# EAGLE design IO4-IR-Detector-Active (EAGLE 7.7.0)
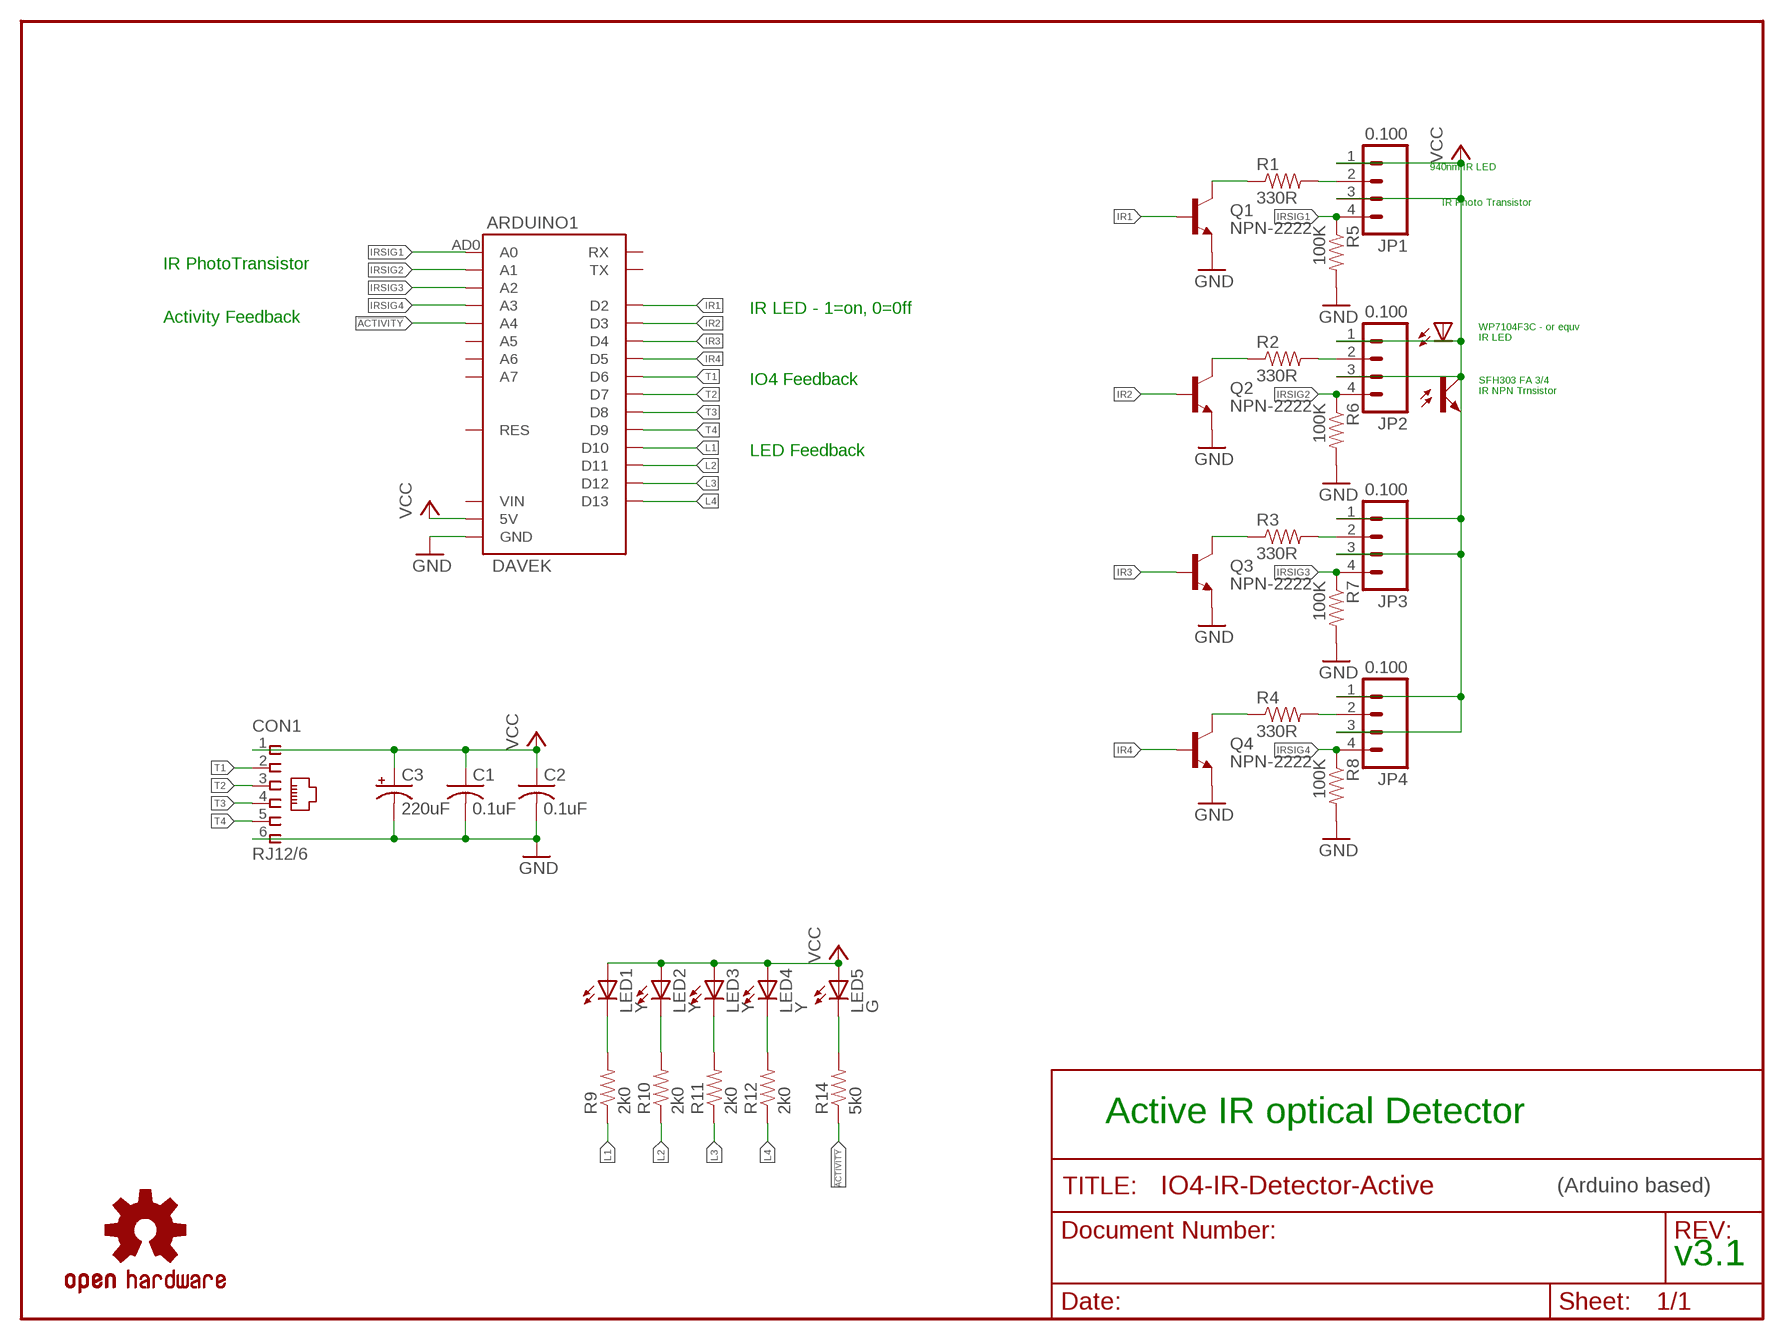
[diagram p0: schematic, sheet 1]

## Parts
ARDUINO1  DAVEK  ARDUINO-PRO-MINIDAVESROBOT  [ARDUINO_PRO_MINI_DAVEK]
C1  0.1uF  CAP0603  [0603-CAP]
C2  0.1uF  CAP0603  [0603-CAP]
C3  220uF  CAP-POL0810  [0810-CAP]
CON1  RJ12/6  CONNECTOR-RJ25-6P6C  [RJ25-PANEL]
JP1  0.100  CONNECTOR-M04LOCK  [1X04_LOCK]
JP2  0.100  CONNECTOR-M04LOCK  [1X04_LOCK]
JP3  0.100  CONNECTOR-M04LOCK  [1X04_LOCK]
JP4  0.100  CONNECTOR-M04LOCK  [1X04_LOCK]
LED1  Y  LED0603-LED  [0603-LED]
LED2  Y  LED0603-LED  [0603-LED]
LED3  Y  LED0603-LED  [0603-LED]
LED4  Y  LED0603-LED  [0603-LED]
LED5  G  LED0603-LED  [0603-LED]
OSH_LOGO  DOC-OSHW-LOGO-S  [OSHW-LOGO-S]
Q1  NPN-2222  NPN-SOT23  [SOT23]
Q2  NPN-2222  NPN-SOT23  [SOT23]
Q3  NPN-2222  NPN-SOT23  [SOT23]
Q4  NPN-2222  NPN-SOT23  [SOT23]
R1  330R  R0603-RES  [0603-RES]
R2  330R  R0603-RES  [0603-RES]
R3  330R  R0603-RES  [0603-RES]
R4  330R  R0603-RES  [0603-RES]
R5  100K  R0603-RES  [0603-RES]
R6  100K  R0603-RES  [0603-RES]
R7  100K  R0603-RES  [0603-RES]
R8  100K  R0603-RES  [0603-RES]
R9  2k0  R0603-RES  [0603-RES]
R10  2k0  R0603-RES  [0603-RES]
R11  2k0  R0603-RES  [0603-RES]
R12  2k0  R0603-RES  [0603-RES]
R14  5k0  R0603-RES  [0603-RES]

## Nets
!ACTIVITY: ARDUINO1.AD4(A4) R14.1
GND [Power]: ARDUINO1.GND@1(GND) ARDUINO1.GND@2(GND) ARDUINO1.GND@4(GND) C1.2 C2.2 C3.- CON1.6 Q1.2(E) Q2.2(E) Q3.2(E) Q4.2(E) R5.2 R6.2 R7.2 R8.2
IR1: ARDUINO1.D2 Q1.1(B)
IR2: ARDUINO1.D3 Q2.1(B)
IR3: ARDUINO1.D4 Q3.1(B)
IR4: ARDUINO1.D5 Q4.1(B)
IRDRIVE1 [Power]: Q1.3(C) R1.1
IRDRIVE2 [Power]: Q2.3(C) R2.1
IRDRIVE3 [Power]: Q3.3(C) R3.1
IRDRIVE4 [Power]: Q4.3(C) R4.1
IRSIG1 [Power]: ARDUINO1.AD0(A0) JP1.4 R5.1
IRSIG2 [Power]: ARDUINO1.AD1(A1) JP2.4 R6.1
IRSIG3 [Power]: ARDUINO1.AD2(A2) JP3.4 R7.1
IRSIG4 [Power]: ARDUINO1.AD3(A3) JP4.4 R8.1
L1: ARDUINO1.D10 R9.1
L2: ARDUINO1.D11 R10.1
L3 [Power]: ARDUINO1.D12 R11.1
L4 [Power]: ARDUINO1.D13 R12.1
N$1: LED5.C R14.2
N$2 [Power]: JP1.2 R1.2
N$3: JP2.2 R2.2
N$4 [Power]: JP3.2 R3.2
N$5: JP4.2 R4.2
N$10 [Power]: LED1.C R9.2
N$11 [Power]: LED2.C R10.2
N$12 [Power]: LED3.C R11.2
N$13 [Power]: LED4.C R12.2
T1: ARDUINO1.D6 CON1.2
T2 [Power]: ARDUINO1.D7 CON1.3
T3 [Power]: ARDUINO1.D8 CON1.4
T4: ARDUINO1.D9 CON1.5
VCC [Power]: ARDUINO1.5V C1.1 C2.1 C3.+ CON1.1 JP1.1 JP1.3 JP2.1 JP2.3 JP3.1 JP3.3 JP4.1 JP4.3 LED1.A LED2.A LED3.A LED4.A LED5.A
Unconnected: ARDUINO1.AD5(A5) ARDUINO1.AD6(A6) ARDUINO1.AD7(A7) ARDUINO1.RES ARDUINO1.RES@1(RES) ARDUINO1.RX ARDUINO1.TX@1(TX) ARDUINO1.VIN

## Notes on the sheet
- 940nm IR LED
- IR Photo Transistor
- IR PhotoTransistor
- IR LED - 1=on, 0=0ff
- Activity Feedback
- WP7104F3C - or equv
  IR LED
- IO4 Feedback
- SFH303 FA 3/4
  IR NPN Trnsistor
- LED Feedback
- Active IR optical Detector
- (Arduino based)
- v3.1

## Library data of the parts
ARDUINO1 = SPCoast:ARDUINO-PRO-MINI
C1 C2 = SPCoast:CAP*
C3 = SPCoast:CAP-POL*
CON1 = SPCoast:CONNECTOR-RJ25: AMP connector; AMP: 520250-3; OPL: none
JP1-JP4 = SPCoast:CONNECTOR-M04: Header 4 Standard 4-pin 0.1" header. Use with straight break away headers (SKU : PRT-00116), right angle break away headers (PRT-00553), swiss pins (PRT-00743), machine pins (PRT-00117), and female headers (PRT-00115). Molex polarized connector foot print use with SKU : PRT-08231 with associated crimp pins and housings. 1MM SMD Version SKU: PRT-10208
LED1-LED5 = SPCoast:LED*
OSH_LOGO = SPCoast:DOC-OSHW-LOGO-: Open Source Hardware Logo This logo indicates the piece of hardware it is found on incorporates a OSHW license and/or adheres to the definition of open source hardware http://freedomdefined.org/OSHW Creative Commons - Attribution - ShareAlike 3.0
Q1-Q4 = SPCoast:NPN: Transistor NPN BJT configuration in SOT23 package. MMBT2222 is the common NPN we use. Double check BCE configuration again layout.
R1-R12 R14 = SPCoast:R*: Resistor Basic schematic elements and footprints for 0603, 1206, and PTH 1/10th watt (small) resistors.

## Net classes
0 default: width 0.254 mm
1 Power: width 0.254 mm, clearance 0.203 mm
2 DCC: width 1.778 mm, drill 0.039 mm, clearance 0.203 mm

## Board
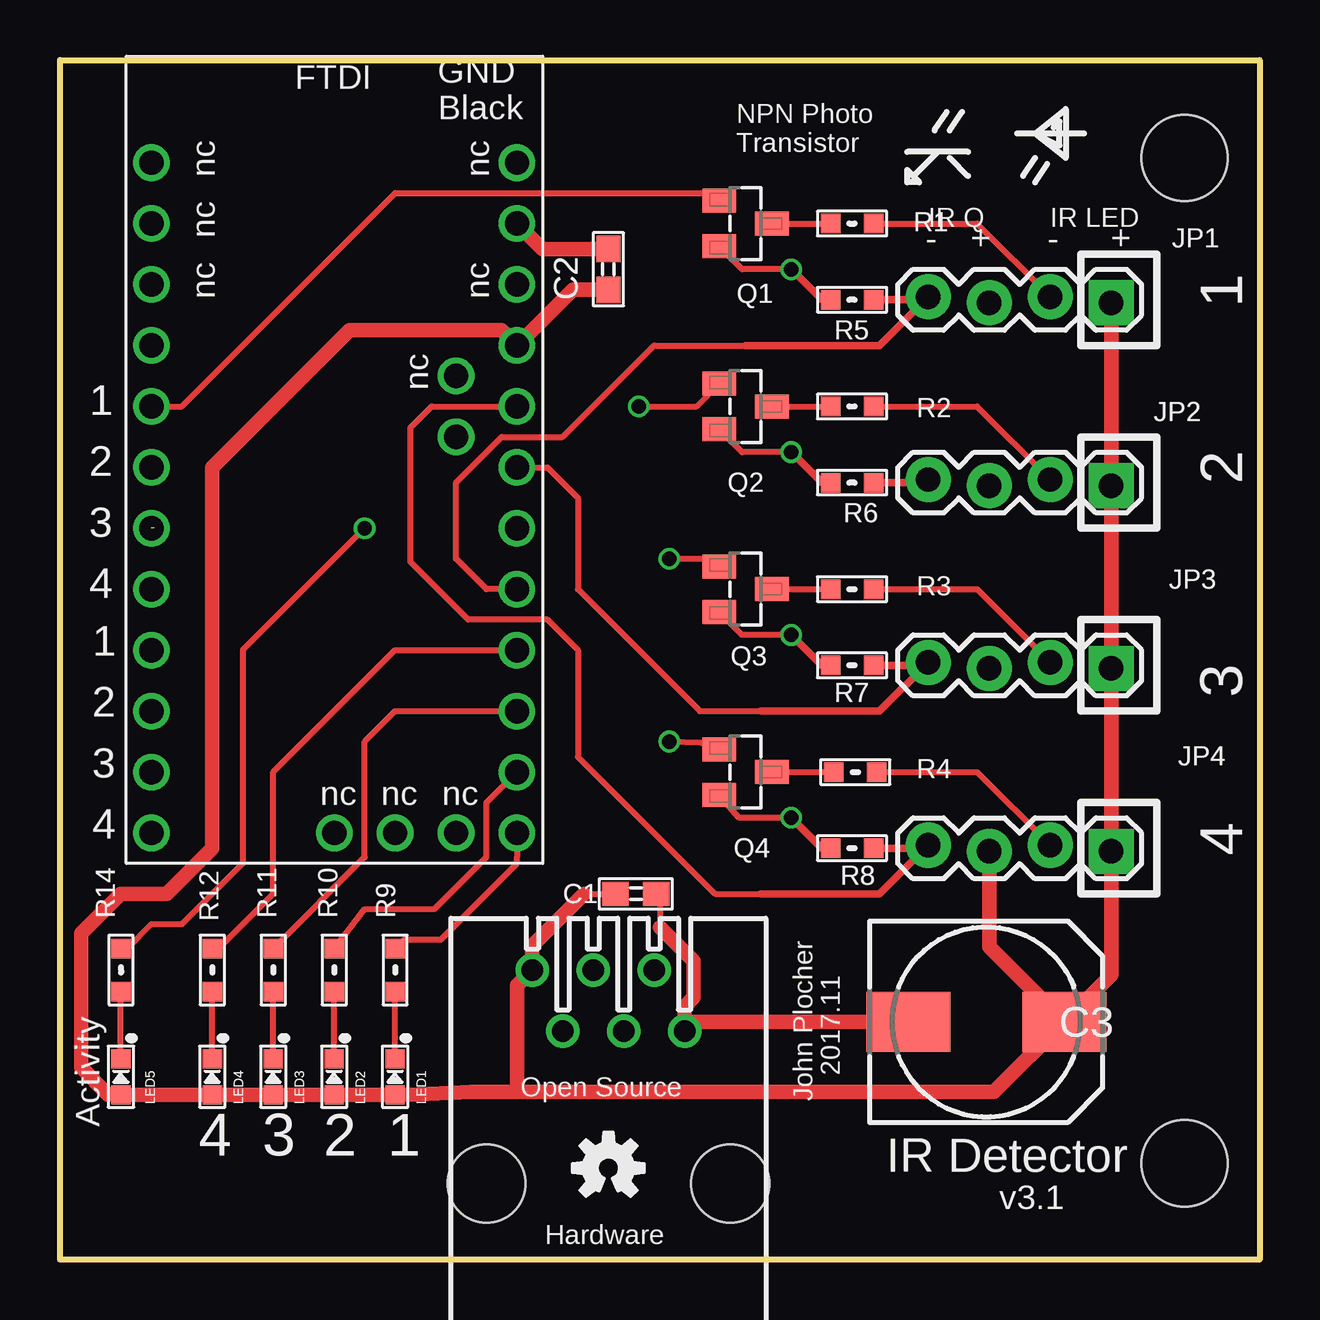
[diagram p1: board, top side]
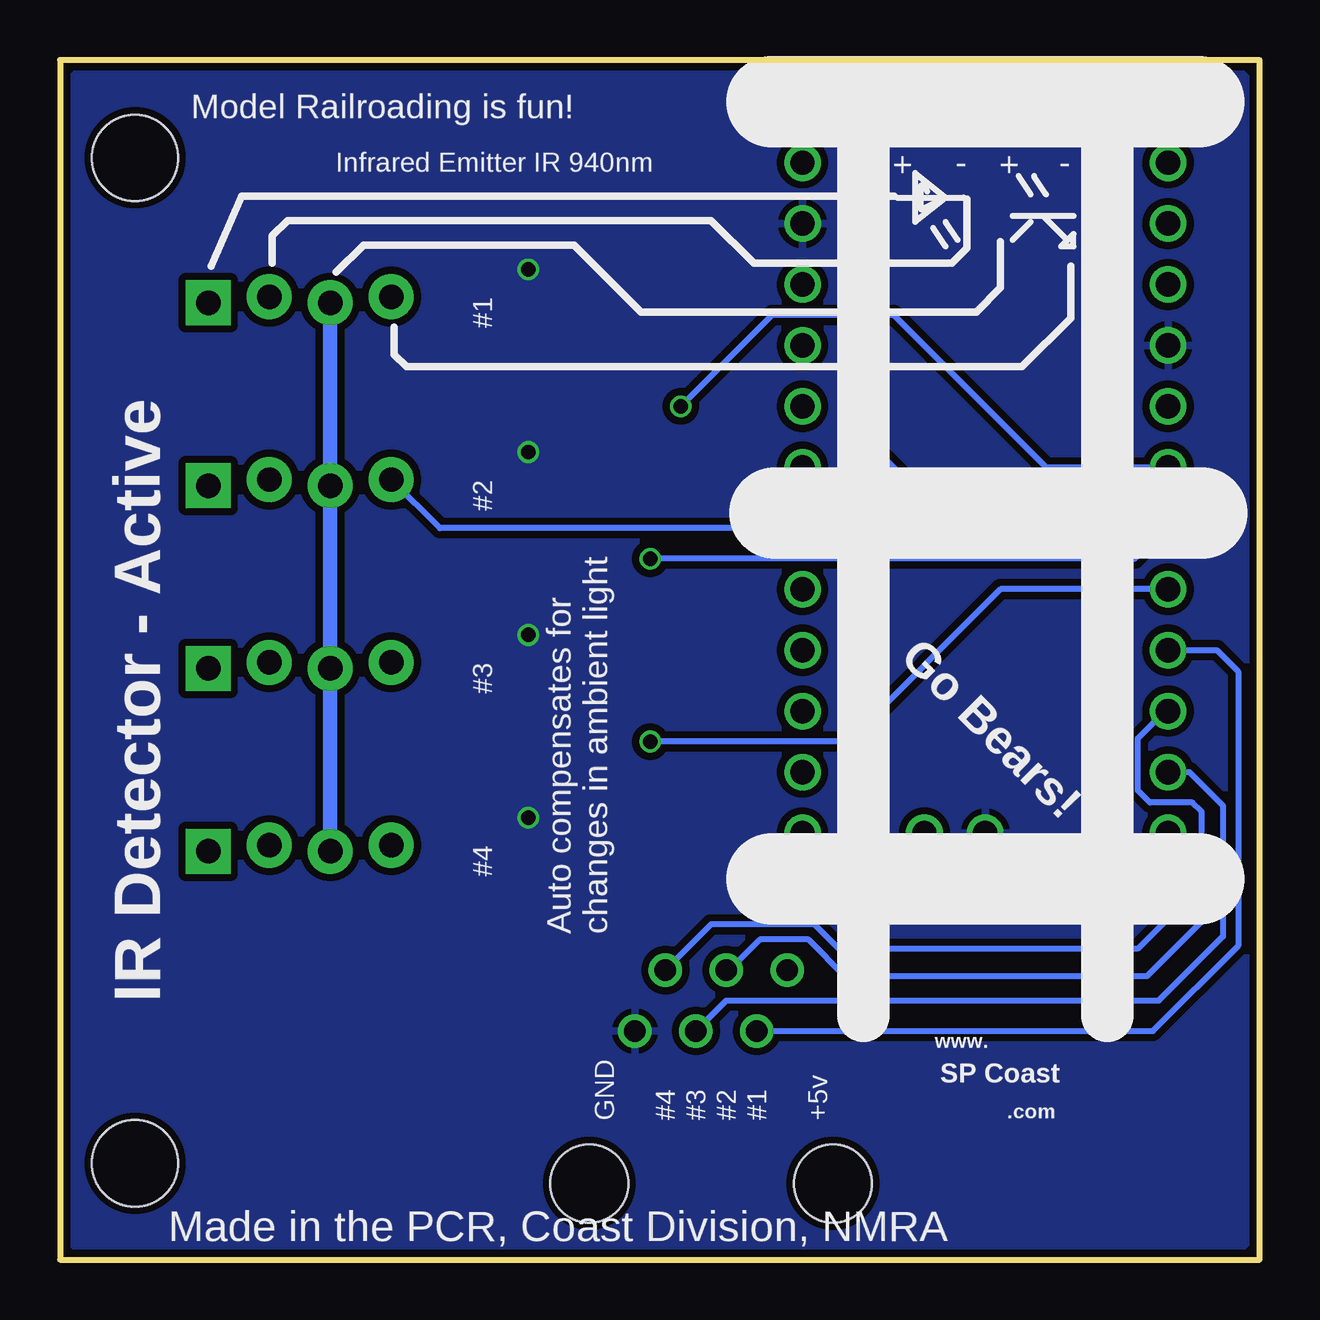
[diagram p2: board, bottom side, seen from below]

Size 50 x 50 mm. Coordinates in mm from the lower left corner, seen from the top.
Outline: 0,0 0,50 50,50 50,0 0,0
Copper layers (1*16): Top 0.035mm / dielectric 1.5mm / Bottom 0.035mm
Design rules "Fusion_eagle_rule_v1.1 *": minimum track width 6mil, minimum drill 12mil, track to track 6mil, track to pad 6mil, pad to pad 6mil, via to via 6mil, smd to smd 0mil, copper to edge 10mil, drill to drill 10mil, minimum pad ring 10mil, minimum via ring 6mil, stop-mask expansion 2mil, vias tented up to drill 100mil, thermal gap 10mil
Holes 3.6 mm at 46.87,45.92 46.87,4.01
vRestrict: area 0,45.7 to 49.5,49.5; area 0,0 to 49.5,3.8

### Footprints (pad centres in the part's own frame; a part is rotated, then mirrored left to right if it is on the bottom)
ARDUINO_PRO_MINI_DAVEK = drill 1.016: 5V 16.51,21.59; AD0 16.51,11.43; AD1 16.51,13.97; AD2 16.51,16.51; AD3 16.51,19.05; AD4 13.97,17.78; AD5 13.97,20.32; AD6 11.43,1.27; AD7 13.97,1.27; D2 1.27,19.05; D3 1.27,16.51; D4 1.27,13.97; D5 1.27,11.43; D6 1.27,8.89; D7 1.27,6.35; D8 1.27,3.81; D9 1.27,1.27; D10 16.51,1.27; D11 16.51,3.81; D12 16.51,6.35; D13 16.51,8.89; GND@1 16.51,26.67; GND@2 8.89,1.27; GND@4 1.27,21.59; RES 16.51,24.13; RES@1 1.27,24.13; RX 1.27,26.67; TX@1 1.27,29.21; VIN 16.51,29.21
0603-CAP = smd 1.1 x 1: 1 -0.85,0; 2 0.85,0
0810-CAP = smd 3.5 x 2.5: + 3.25,0; - -3.25,0
RJ25-PANEL = drill 0.889: 1 -3.175,8.89; 2 -1.905,6.35; 3 -0.635,8.89; 4 0.635,6.35; 5 1.905,8.89; 6 3.175,6.35 | hole 3.251: -5.08,0; 5.08,0
1X04_LOCK = drill 1.016 pad 1.88 square: 1 0,0.127 | drill 1.016 pad 1.88: 2 2.54,-0.127; 3 5.08,0.127; 4 7.62,-0.127
0603-LED = smd 0.8 x 0.8: A 0.75,0; C -0.75,0
SOT23 = smd 1.4 x 1: 1 1.1,-0.95; 2 1.1,0.95; 3 -1.1,0
0603-RES = smd 0.813 x 0.813: 1 -0.889,0; 2 0.889,0

### Placement (x,y rotation side)
ARDUINO1  2.54,16.51 0 top
C1  24,15.24 0 top
C2  22.86,41.27 90 top
C3  38.61,9.91 0 top
CON1  22.86,3.17 0 top
JP1  43.81,40.01 180 top
JP2  43.81,32.38 180 top
JP3  43.81,24.77 180 top
JP4  43.81,17.14 180 top
LED1  13.97,7.62 270 top
LED2  11.43,7.62 270 top
LED3  8.89,7.62 270 top
LED4  6.35,7.62 270 top
LED5  2.54,7.62 270 top
OSH_LOGO  22.86,3.81 0 top
Q1  28.57,43.18 180 top
Q2  28.57,35.56 180 top
Q3  28.57,27.94 180 top
Q4  28.57,20.32 180 top
R1  33.02,43.18 0 top
R2  33.02,35.56 0 top
R3  33.02,27.94 0 top
R4  33.15,20.32 0 top
R5  33.02,40.01 180 top
R6  33.02,32.38 180 top
R7  33.02,24.77 180 top
R8  33.02,17.14 180 top
R9  13.97,12.06 270 top
R10  11.43,12.06 270 top
R11  8.89,12.06 270 top
R12  6.35,12.06 270 top
R14  2.54,12.06 270 top

### Tracks (layer width: path | path; a pad name or v marks a point on that pad's centre or on a via)
!ACTIVITY  (via drill 0.6)
  Top 0.254: v12.7,30.48 7.62,25.4 7.62,16.51 5.08,13.97 3.81,13.97 2.79,12.95 R14.1
  Bottom 0.254: v12.7,30.48 ARDUINO1.AD4
GND  (via drill 0.6)
  Top 0.254: C1.2 25.02,15.12 25.02,13.84 | 26.42,9.91 CON1.6 | 27.69,19.03 Q4.2 28.3,18.41 v30.48,18.41 | v30.48,41.27 28.43,41.27 Q1.2 | v30.48,33.66 28.43,33.66 Q2.2 | v30.48,26.04 28.43,26.04 Q3.2
  Top 0.305: R5.2 31.75,40.01 v30.48,41.27 | R6.2 31.75,32.38 v30.48,33.66 | R7.2 31.75,24.77 v30.48,26.04 | R8.2 31.75,17.14 v30.48,18.41
  Top 0.61: 25.02,13.84 26.42,12.45 26.42,10.92 26.04,10.54 CON1.6 | C3.- 26.42,9.91 | C2.2 20.11,42.12 ARDUINO1.GND@1
  pour Bottom (isolate 0.305): 1.02,49.73 49.03,49.73 50.3,48.46 50.3,1.47 49.03,0.2 1.02,0.2 -0.25,1.47 -0.25,48.46
IR1
  Top 0.254: ARDUINO1.D2 5.08,35.56 13.97,44.45 27.16,44.45 Q1.1
IR2  (via drill 0.6)
  Top 0.254: v24.13,35.56 26.52,35.56 Q2.1
  Bottom 0.254: ARDUINO1.D3 8.89,33.02 15.24,39.37 20.32,39.37 v24.13,35.56
IR3  (via drill 0.6)  (1 unrouted)
  Top 0.254: v25.4,29.21 27.48,29.21 Q3.1
  Bottom 0.254: 3.94,30.48 5.21,29.21 v25.4,29.21
IR4  (via drill 0.6)
  Top 0.254: v25.4,21.59 26.71,21.55 Q4.1
  Bottom 0.254: ARDUINO1.D5 10.79,27.94 17.14,21.59 v25.4,21.59
IRDRIVE1
  Top 0.254: Q1.3 R1.1
IRDRIVE2
  Top 0.254: Q2.3 R2.1
IRDRIVE3
  Top 0.254: Q3.3 R3.1
IRDRIVE4
  Top 0.254: Q4.3 R4.1
IRSIG1
  Top 0.254: ARDUINO1.AD0 17.78,27.94 16.51,29.21 16.51,32.38 18.41,34.29 20.95,34.29 24.77,38.1 28.57,38.1
  Top 0.305: R5.1 36.07,40.01 JP1.4 34.16,38.1 28.57,38.1
IRSIG2
  Top 0.305: R6.1 36.07,32.38 JP2.4
  Bottom 0.254: ARDUINO1.AD1 34.16,30.48 JP2.4
IRSIG3
  Top 0.254: ARDUINO1.AD2 20.32,33.02 21.59,31.75 21.59,27.94 26.67,22.86 29.21,22.86
  Top 0.305: R7.1 36.07,24.77 JP3.4 34.16,22.86 29.21,22.86
IRSIG4
  Top 0.254: ARDUINO1.AD3 15.49,35.56 14.61,34.67 14.61,29.08 17.02,26.67 20.32,26.67 21.59,25.4 21.59,20.95 27.3,15.24 29.21,15.24
  Top 0.305: R8.1 36.07,17.14 JP4.4 34.16,15.24 29.21,15.24
L1
  Top 0.254: R9.1 14.35,13.34 15.88,13.34 19.05,16.51 19.05,16.77 19.05,17.14 ARDUINO1.D10
L2
  Top 0.254: R10.1 12.7,14.61 15.61,14.61 17.78,16.77 17.78,19.05 ARDUINO1.D11
L3
  Top 0.254: R11.1 12.7,16.77 12.7,21.59 13.97,22.86 ARDUINO1.D12
L4
  Top 0.254: R12.1 6.35,12.7 8.89,15.24 8.89,20.32 13.97,25.4 ARDUINO1.D13
N$1
  Top 0.254: LED5.C R14.2
N$2
  Top 0.254: R1.2 38.23,43.18 JP1.2
N$3
  Top 0.254: R2.2 38.23,35.56 JP2.2
N$4
  Top 0.254: R3.2 38.23,27.94 JP3.2
N$5
  Top 0.254: R4.2 38.23,20.32 JP4.2
N$10
  Top 0.254: LED1.C R9.2
N$11
  Top 0.254: LED2.C R10.2
N$12
  Top 0.254: LED3.C R11.2
N$13
  Top 0.254: LED4.C R12.2
T1
  Bottom 0.254: ARDUINO1.D6 1.78,25.4 0.89,24.51 0.89,13.08 4.45,9.53 CON1.2
T2
  Bottom 0.254: ARDUINO1.D7 3.94,22.86 5.08,21.72 5.08,19.56 4.57,19.05 2.79,19.05 2.41,18.67 2.41,14.1 4.7,11.81 17.27,11.81 18.8,13.34 20.83,13.34 22.1,12.06 CON1.3
T3
  Bottom 0.254: ARDUINO1.D8 2.92,20.32 1.52,18.92 1.52,13.46 4.19,10.79 22.23,10.79 CON1.4
T4
  Bottom 0.254: ARDUINO1.D9 3.81,14.22 5.08,12.95 17.53,12.95 18.54,13.97 22.86,13.97 CON1.5
VCC
  Top 0.254: LED5.A 2.02,6.87 | 21.84,15.24 C1.1 | LED1.A 14.49,6.87
  Top 0.61: 19.05,6.99 19.05,11.43 CON1.1 19.68,13.08 21.84,15.24 | 14.49,6.87 17.14,6.99 19.05,6.99 | 2.02,6.87 0.89,8 0.89,13.59 2.54,15.24 4.45,15.24 6.35,17.14 6.35,33.02 12.06,38.73 18.41,38.73 ARDUINO1.5V 21.38,40.42 C2.1 | LED5.A LED4.A LED3.A LED2.A LED1.A | JP1.1 JP2.1 JP3.1 JP4.1 43.81,11.86 C3.+ | JP4.3 38.73,13.03 C3.+ | 19.05,6.99 38.94,6.99 C3.+
  Bottom 0.61: JP1.3 JP2.3 JP3.3 JP4.3

### Text on the board
tPlace: nc | nc | NPN Photo / Transistor | nc | IR Q | IR LED | nc | nc | - | + | - | + | 1 | nc | 1 | 2 | 2 | 3 | 4 | 1 | 2 | 3 | 3 | nc | nc | nc | 4 | 4 | 2017.11 | Open Source | John Plocher | Activity | 4 | 3 | 2 | 1 | IR Detector | v3.1 | Hardware
bPlace: Model Railroading is fun! | Infrared Emitter IR 940nm | - | + | - | + | #1 | #2 | #3 | Go Bears! | #4 | Auto compensates for / changes in ambient light | IR Detector - Active | www. | SP Coast | .com | +5v | #1 | #2 | #3 | #4 | GND | Made in the PCR, Coast Division, NMRA
Document: Silicon NPN Phototransistor | Infrared Emitters IR 940nm
_tNames: R1 | JP1 | C2 | Q1 | R5 | JP2 | R2 | Q2 | R6 | JP3 | R3 | Q3 | R7 | JP4 | R4 | Q4 | R8 | C1 | R14 | R12 | R11 | R10 | R9 | C3 | LED5 | LED4 | LED3 | LED2 | LED1 | CON1